# Altium schematic sheet Sheet1.SchDoc
size 558 x 431 mm; SheetNumber: 1; SheetTotal: 1
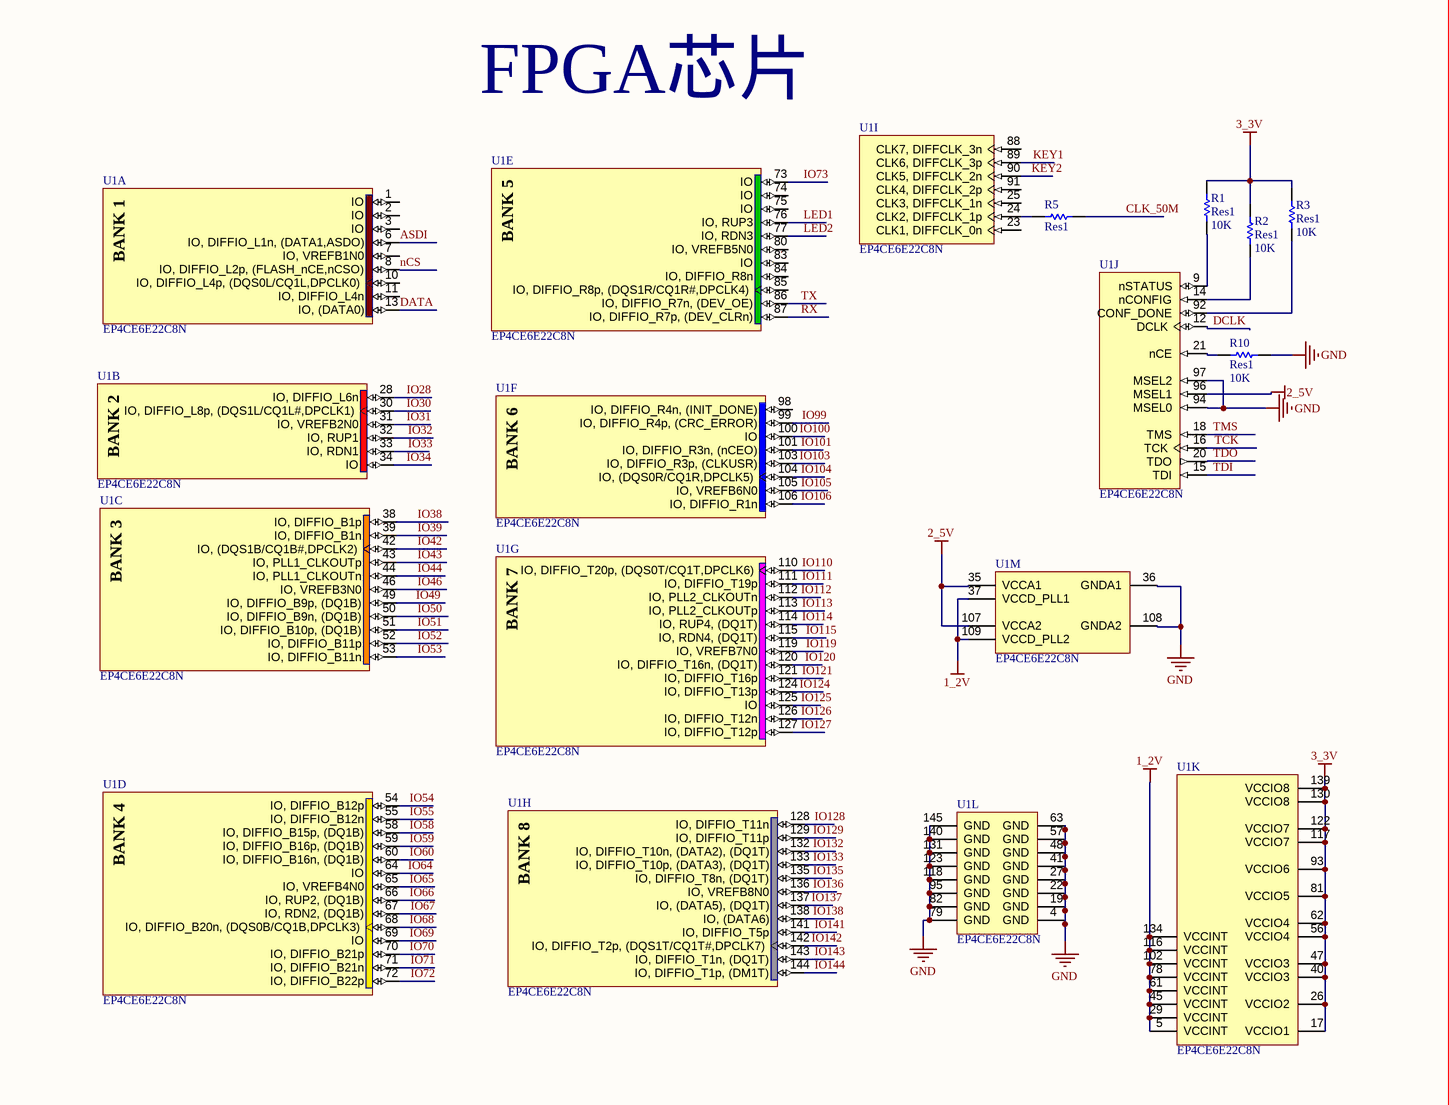
[diagram p0: Sheet1.SchDoc, top left]
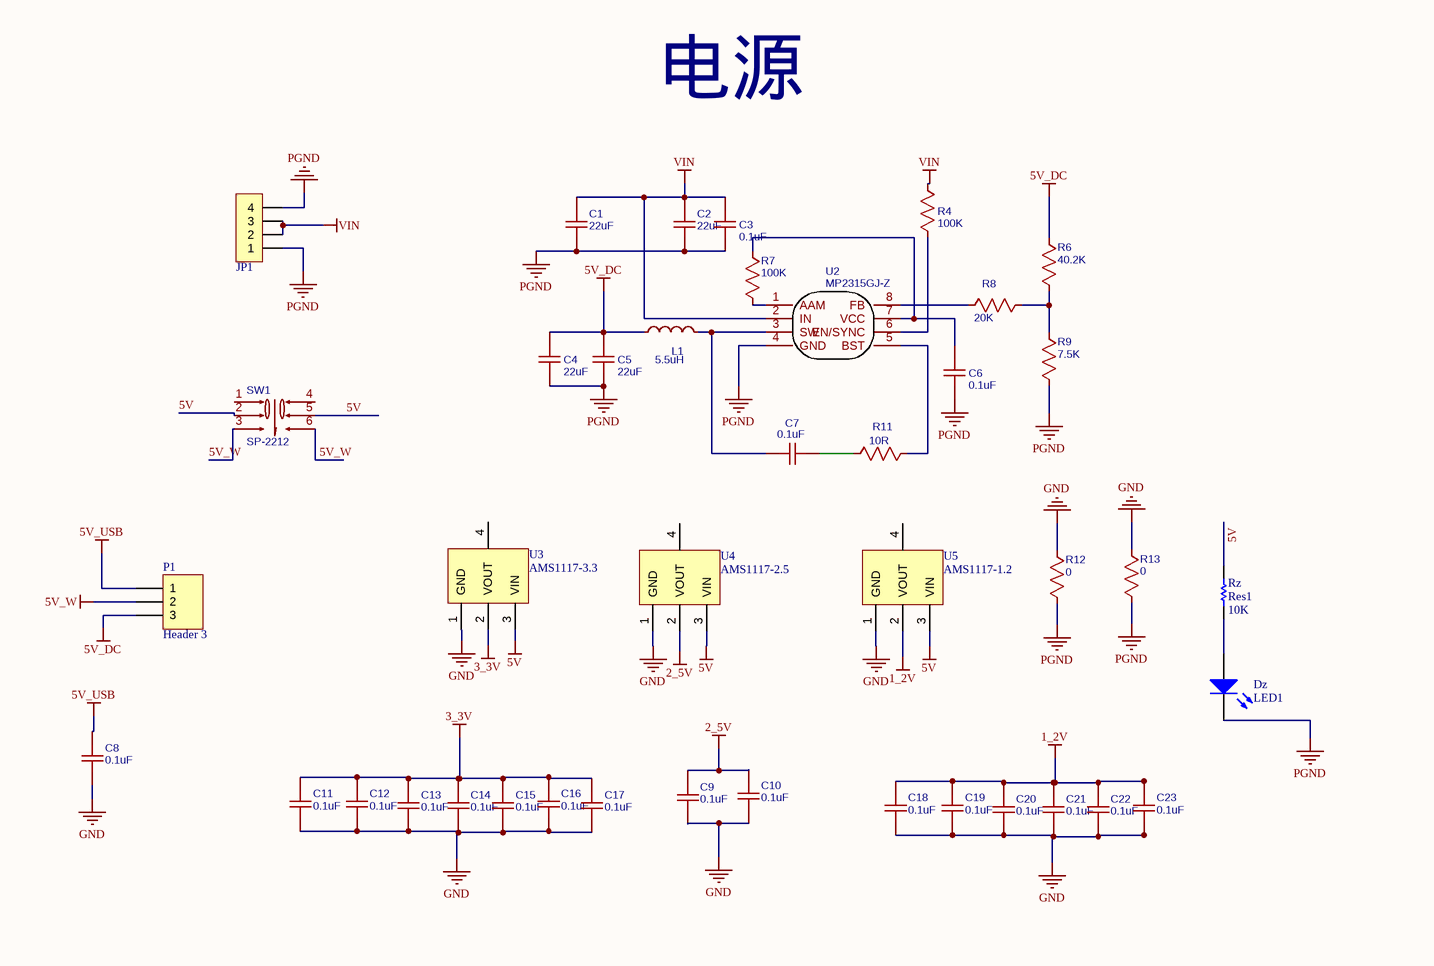
[diagram p1: Sheet1.SchDoc, top right]
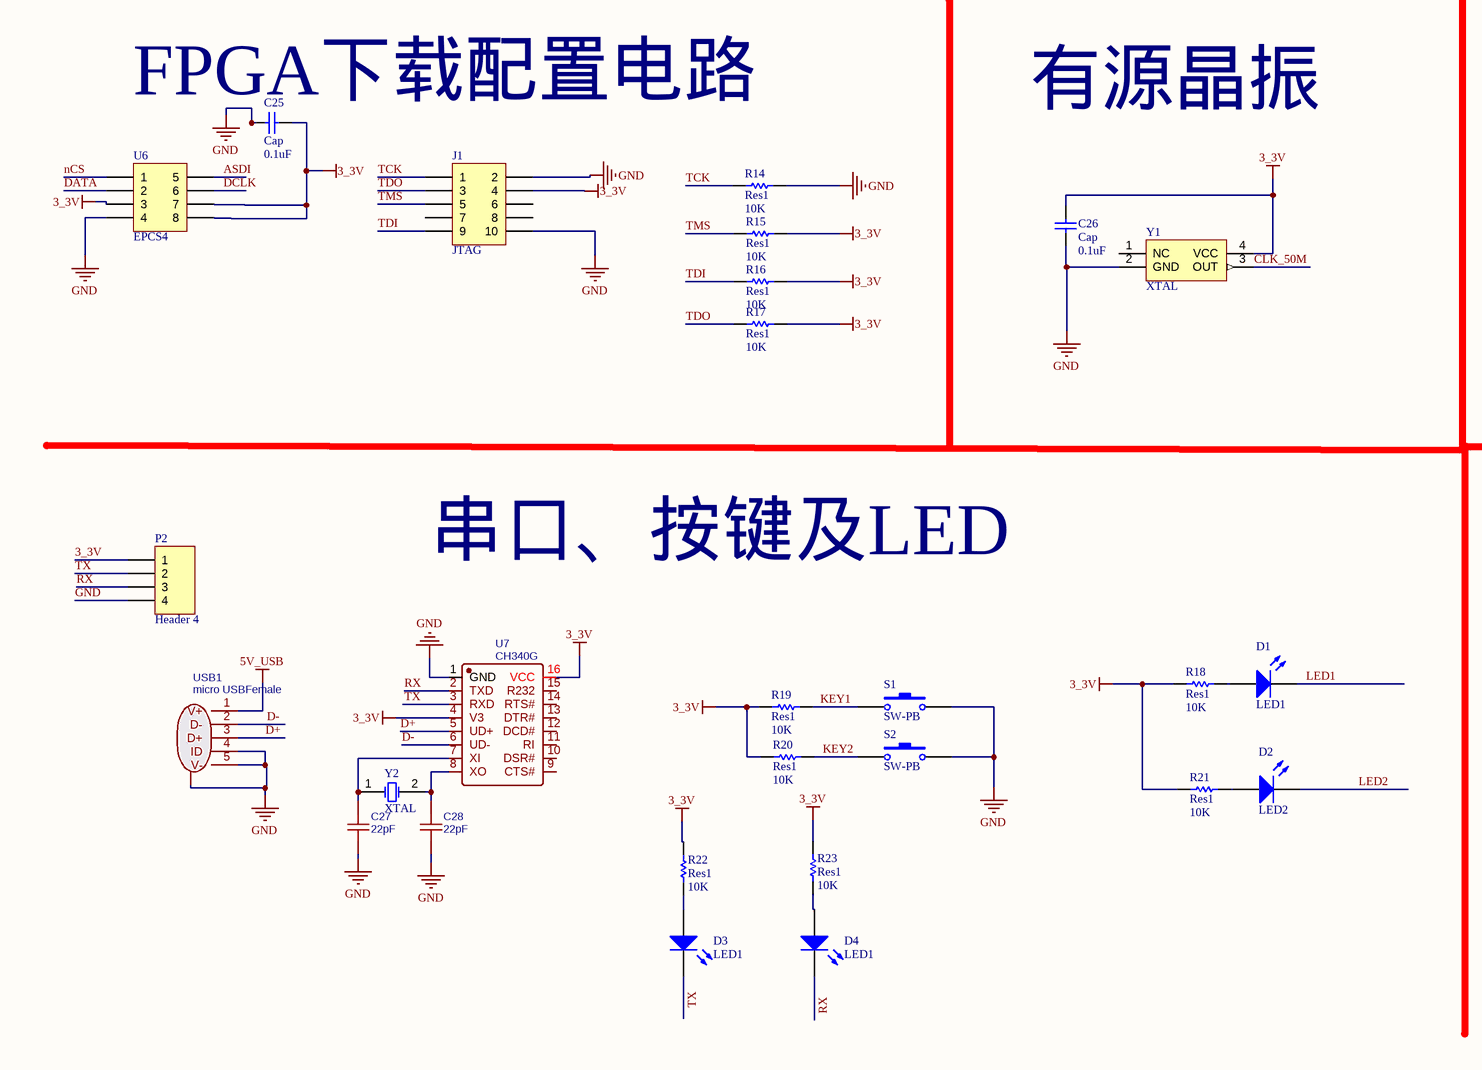
[diagram p2: Sheet1.SchDoc, bottom left]
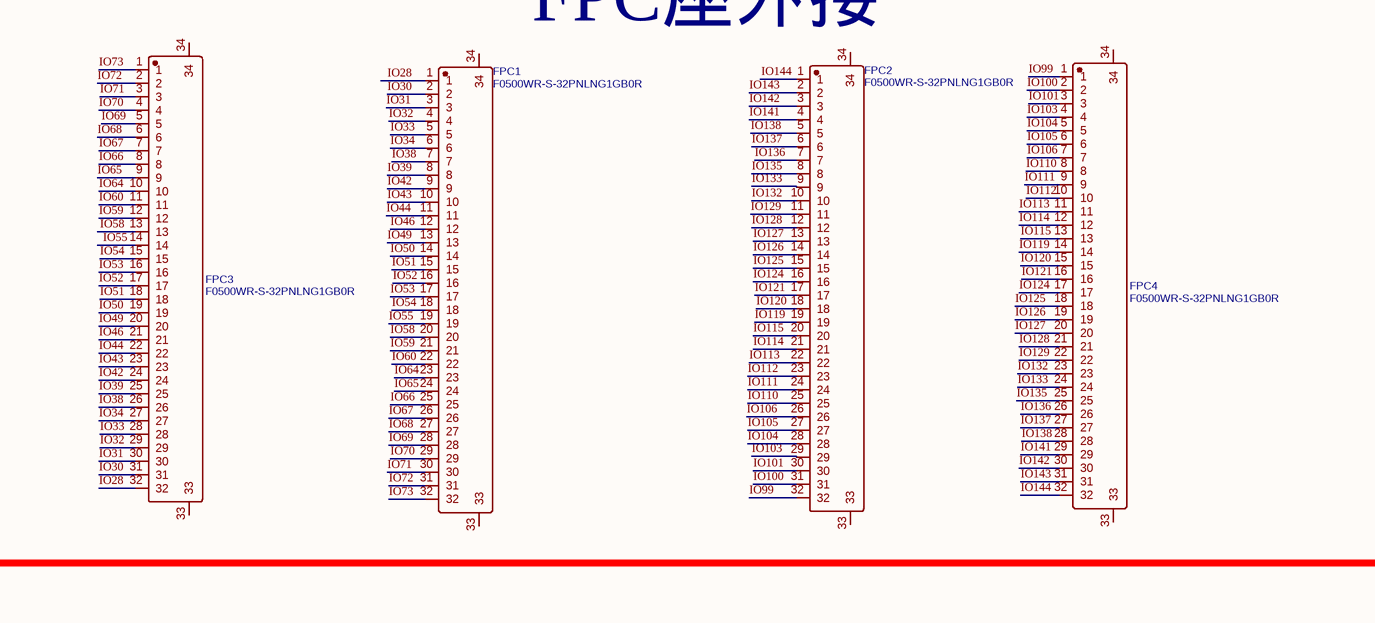
[diagram p3: Sheet1.SchDoc, bottom right]

## Parts
C1  22uF  [C 0805_M]
C2  22uF  [C 0603_M]
C3  0.1uF  [C 0805_M]
C4  22uF  [C 0805_M]
C5  22uF  [C 0805_M]
C6  0.1uF  [C 0603_M]
C7  0.1uF  [C 0805_M]
C8  0.1uF  [C 0805_M]
C9  0.1uF  [C 0603_M]
C10  0.1uF  [C 0603_M]
C11  0.1uF  [C 0603_M]
C12  0.1uF  [C 0603_M]
C13  0.1uF  [C 0603_M]
C14  0.1uF  [C 0603_M]
C15  0.1uF  [C 0603_M]
C16  0.1uF  [C 0603_M]
C17  0.1uF  [C 0603_M]
C18  0.1uF  [C 0603_M]
C19  0.1uF  [C 0603_M]
C20  0.1uF  [C 0603_M]
C21  0.1uF  [C 0603_M]
C22  0.1uF  [C 0603_M]
C23  0.1uF  [C 0603_M]
C25  Cap  value 0.1uF  [C 0805_M]
C26  Cap  value 0.1uF  [C 0805_M]
C27  22pF  [C 0603_M]
C28  22pF  [C 0603_M]
D1  LED1  [LED-0805]
D2  LED2  [LED-0805]
D3  LED1  [LED-0805]
D4  LED1  [LED-0805]
Dz  LED1  [LED-0805]
FPC1  F0500WR-S-32PNLNG1GB0R  [FPC0.5 2H-WS-32P]
FPC2  F0500WR-S-32PNLNG1GB0R  [FPC0.5 2H-WS-32P]
FPC3  F0500WR-S-32PNLNG1GB0R  [FPC0.5 2H-WS-32P]
FPC4  F0500WR-S-32PNLNG1GB0R  [FPC0.5 2H-WS-32P]
J1  JTAG  [牛角座10p]
JP1  HDR-1X4  [KF128-5.08-4P]  (value not drawn)
L1  5.5uH  [L-SMD-0630]
P1  Header 3  [HDR1X3]
P2  Header 4  [HDR1X4]
R1  Res1  value 10K  [R 0603_M]
R2  Res1  value 10K  [R 0603_M]
R3  Res1  value 10K  [R 0603_M]
R4  100K  [R 0603_M]
R5  Res1  [R 0603_M]
R6  40.2K  [R 0603_M]
R7  100K  [R 0603_M]
R8  20K  [R 0603_M]
R9  7.5K  [R 0603_M]
R10  Res1  value 10K  [R 0603_M]
R11  10R  [R 0603_M]
R12  0  [R 0603_M]
R13  0  [R 0603_M]
R14  Res1  value 10K  [R 0603_M]
R15  Res1  value 10K  [R 0603_M]
R16  Res1  value 10K  [R 0603_M]
R17  Res1  value 10K  [R 0603_M]
R18  Res1  value 10K  [R 0603_M]
R19  Res1  value 10K  [R 0603_M]
R20  Res1  value 10K  [R 0603_M]
R21  Res1  value 10K  [R 0603_M]
R22  Res1  value 10K  [R 0603_M]
R23  Res1  value 10K  [R 0603_M]
Rz  Res1  value 10K  [R 0603_M]
S1  SW-PB  [SPST4]
S2  SW-PB  [SPST4]
SW1  SP-2212  [自锁开关]
U1  EP4CE6E22C8N  [EQFP144_A-165_D2-54_N]  (parts A,B,C,D,E,F,G,H,I,J,K,L,M of 13)
U2  MP2315GJ-Z  [SOT23-8N]
U3  AMS1117-3.3  [SOT223_N]
U4  AMS1117-2.5  [SOT223_N]
U5  AMS1117-1.2  [SOT223_N]
U6  EPCS4  [SOP8]
U7  CH340G  [SOIC-16_L9.9-W3.9-P1.27-LS6.0-BL]
USB1  micro USBFemale  [MICRO-USB-SMD_5P-P0.65-H-F_C10418]
Y1  XTAL  [OSC-SMD_4P-L7.0-W5.0-BL]
Y2  XTAL  [标准晶振]

## Nets
1_2V: C18.2 C19.2 C20.2 C21.2 C22.2 C23.2 U1.5(VCCINT) U1.29(VCCINT) U1.37(VCCD_PLL1) U1.45(VCCINT) U1.61(VCCINT) U1.78(VCCINT) U1.102(VCCINT) U1.109(VCCD_PLL2) U1.116(VCCINT) U1.134(VCCINT) U5.2(VOUT)
2_5V: C9.2 C10.2 U1.35(VCCA1) U1.96(MSEL1) U1.107(VCCA2) U4.2(VOUT)
3_3V: C11.2 C12.2 C13.2 C14.2 C15.2 C16.2 C17.2 C25.2 C26.2 J1.4 P2.1 R1.2 R2.2 R3.2 R15.2 R16.2 R17.2 R18.2 R19.2 R20.2 R21.2 R22.1 R23.1 U1.17(VCCIO1) U1.26(VCCIO2) U1.40(VCCIO3) U1.47(VCCIO3) U1.56(VCCIO4) U1.62(VCCIO4) U1.81(VCCIO5) U1.93(VCCIO6) U1.117(VCCIO7) U1.122(VCCIO7) U1.130(VCCIO8) U1.139(VCCIO8) U3.2(VOUT) U6.3 U6.7 U6.8 U7.4(V3) U7.16(VCC) Y1.4(VCC)
5V: Rz.2 SW1.2 SW1.5 U3.3(VIN) U4.3(VIN) U5.3(VIN)
5V_DC: C4.2 C5.2 L1.1 P1.3 R6.1
5V_USB: C8.2 P1.1 USB1.1(V+)
5V_W: P1.2 SW1.3 SW1.6
GND: C8.1 C9.1 C10.1 C11.1 C12.1 C13.1 C14.1 C15.1 C16.1 C17.1 C18.1 C19.1 C20.1 C21.1 C22.1 C23.1 C25.1 C26.1 C27.1 C28.1 J1.2 J1.10 P2.4 R10.1 R12.1 R13.1 R14.2 S1.2 S2.2 U1.4(GND) U1.19(GND) U1.22(GND) U1.27(GND) U1.36(GNDA1) U1.41(GND) U1.48(GND) U1.57(GND) U1.63(GND) U1.79(GND) U1.82(GND) U1.94(MSEL0) U1.95(GND) U1.97(MSEL2) U1.108(GNDA2) U1.118(GND) U1.123(GND) U1.131(GND) U1.140(GND) U1.145(GND) U3.1(GND) U4.1(GND) U5.1(GND) U6.4 U7.1(GND) USB1.0(MTN) USB1.4(ID) USB1.5(V-) Y1.2(GND)
PGND: C1.2 C2.2 C3.1 C4.1 C5.1 C6.1 Dz.2(K) JP1.1 JP1.4 R9.2 R12.2 R13.2 U2.4(GND)
VIN: C1.1 C2.1 C3.2 JP1.2 JP1.3 R4.2 U2.2(IN)
ASDI: U1.6(IO,_DIFFIO_L1n,_(DATA1,ASDO)) U6.5
CLK_50M: R5.2 Y1.3(OUT)
D+: U7.5(UD+) USB1.3(D+)
D-: U7.6(UD-) USB1.2(D-)
DATA: U1.13(IO,_(DATA0)) U6.2
DCLK: U1.12(DCLK) U6.6
IO28: FPC1.1 FPC3.32 U1.28(IO,_DIFFIO_L6n)
IO30: FPC1.2 FPC3.31 U1.30(IO,_DIFFIO_L8p,_(DQS1L/CQ1L#,DPCLK1))
IO31: FPC1.3 FPC3.30 U1.31(IO,_VREFB2N0)
IO32: FPC1.4 FPC3.29 U1.32(IO,_RUP1)
IO33: FPC1.5 FPC3.28 U1.33(IO,_RDN1)
IO34: FPC1.6 FPC3.27 U1.34(IO)
IO38: FPC1.7 FPC3.26 U1.38(IO,_DIFFIO_B1p)
IO39: FPC1.8 FPC3.25 U1.39(IO,_DIFFIO_B1n)
IO42: FPC1.9 FPC3.24 U1.42(IO,_(DQS1B/CQ1B#,DPCLK2))
IO43: FPC1.10 FPC3.23 U1.43(IO,_PLL1_CLKOUTp)
IO44: FPC1.11 FPC3.22 U1.44(IO,_PLL1_CLKOUTn)
IO46: FPC1.12 FPC3.21 U1.46(IO,_VREFB3N0)
IO49: FPC1.13 FPC3.20 U1.49(IO,_DIFFIO_B9p,_(DQ1B))
IO50: FPC1.14 FPC3.19 U1.50(IO,_DIFFIO_B9n,_(DQ1B))
IO51: FPC1.15 FPC3.18 U1.51(IO,_DIFFIO_B10p,_(DQ1B))
IO52: FPC1.16 FPC3.17 U1.52(IO,_DIFFIO_B11p)
IO53: FPC1.17 FPC3.16 U1.53(IO,_DIFFIO_B11n)
IO54: FPC1.18 FPC3.15 U1.54(IO,_DIFFIO_B12p)
IO55: FPC1.19 FPC3.14 U1.55(IO,_DIFFIO_B12n)
IO58: FPC1.20 FPC3.13 U1.58(IO,_DIFFIO_B15p,_(DQ1B))
IO59: FPC1.21 FPC3.12 U1.59(IO,_DIFFIO_B16p,_(DQ1B))
IO60: FPC1.22 FPC3.11 U1.60(IO,_DIFFIO_B16n,_(DQ1B))
IO64: FPC1.23 FPC3.10 U1.64(IO)
IO65: FPC1.24 FPC3.9 U1.65(IO,_VREFB4N0)
IO66: FPC1.25 FPC3.8 U1.66(IO,_RUP2,_(DQ1B))
IO67: FPC1.26 FPC3.7 U1.67(IO,_RDN2,_(DQ1B))
IO68: FPC1.27 FPC3.6 U1.68(IO,_DIFFIO_B20n,_(DQS0B/CQ1B,DPCLK3))
IO69: FPC1.28 FPC3.5 U1.69(IO)
IO70: FPC1.29 FPC3.4 U1.70(IO,_DIFFIO_B21p)
IO71: FPC1.30 FPC3.3 U1.71(IO,_DIFFIO_B21n)
IO72: FPC1.31 FPC3.2 U1.72(IO,_DIFFIO_B22p)
IO73: FPC1.32 FPC3.1 U1.73(IO)
IO99: FPC2.32 FPC4.1 U1.99(IO,_DIFFIO_R4p,_(CRC_ERROR))
IO100: FPC2.31 FPC4.2 U1.100(IO)
IO101: FPC2.30 FPC4.3 U1.101(IO,_DIFFIO_R3n,_(nCEO))
IO103: FPC2.29 FPC4.4 U1.103(IO,_DIFFIO_R3p,_(CLKUSR))
IO104: FPC2.28 FPC4.5 U1.104(IO,_(DQS0R/CQ1R,DPCLK5))
IO105: FPC2.27 FPC4.6 U1.105(IO,_VREFB6N0)
IO106: FPC2.26 FPC4.7 U1.106(IO,_DIFFIO_R1n)
IO110: FPC2.25 FPC4.8 U1.110(IO,_DIFFIO_T20p,_(DQS0T/CQ1T,DPCLK6))
IO111: FPC2.24 FPC4.9 U1.111(IO,_DIFFIO_T19p)
IO112: FPC2.23 FPC4.10 U1.112(IO,_PLL2_CLKOUTn)
IO113: FPC2.22 FPC4.11 U1.113(IO,_PLL2_CLKOUTp)
IO114: FPC2.21 FPC4.12 U1.114(IO,_RUP4,_(DQ1T))
IO115: FPC2.20 FPC4.13 U1.115(IO,_RDN4,_(DQ1T))
IO119: FPC2.19 FPC4.14 U1.119(IO,_VREFB7N0)
IO120: FPC2.18 FPC4.15 U1.120(IO,_DIFFIO_T16n,_(DQ1T))
IO121: FPC2.17 FPC4.16 U1.121(IO,_DIFFIO_T16p)
IO124: FPC2.16 FPC4.17 U1.124(IO,_DIFFIO_T13p)
IO125: FPC2.15 FPC4.18 U1.125(IO)
IO126: FPC2.14 FPC4.19 U1.126(IO,_DIFFIO_T12n)
IO127: FPC2.13 FPC4.20 U1.127(IO,_DIFFIO_T12p)
IO128: FPC2.12 FPC4.21 U1.128(IO,_DIFFIO_T11n)
IO129: FPC2.11 FPC4.22 U1.129(IO,_DIFFIO_T11p)
IO132: FPC2.10 FPC4.23 U1.132(IO,_DIFFIO_T10n,_(DATA2),_(DQ1T))
IO133: FPC2.9 FPC4.24 U1.133(IO,_DIFFIO_T10p,_(DATA3),_(DQ1T))
IO135: FPC2.8 FPC4.25 U1.135(IO,_DIFFIO_T8n,_(DQ1T))
IO136: FPC2.7 FPC4.26 U1.136(IO,_VREFB8N0)
IO137: FPC2.6 FPC4.27 U1.137(IO,_(DATA5),_(DQ1T))
IO138: FPC2.5 FPC4.28 U1.138(IO,_(DATA6))
IO141: FPC2.4 FPC4.29 U1.141(IO,_DIFFIO_T5p)
IO142: FPC2.3 FPC4.30 U1.142(IO,_DIFFIO_T2p,_(DQS1T/CQ1T#,DPCLK7))
IO143: FPC2.2 FPC4.31 U1.143(IO,_DIFFIO_T1n,_(DQ1T))
IO144: FPC2.1 FPC4.32 U1.144(IO,_DIFFIO_T1p,_(DM1T))
KEY1: R19.1 S1.1 U1.89(CLK6,_DIFFCLK_3p)
KEY2: R20.1 S2.1 U1.90(CLK5,_DIFFCLK_2n)
LED1: D1.2(K) U1.76(IO,_RUP3)
LED2: D2.2(K) U1.77(IO,_RDN3)
nCS: U1.8(IO,_DIFFIO_L2p,_(FLASH_nCE,nCSO)) U6.1
RX: D4.2(K) P2.3 U1.87(IO,_DIFFIO_R7p,_(DEV_CLRn)) U7.2(TXD)
TCK: J1.1 R14.1 U1.16(TCK)
TDI: J1.9 R16.1 U1.15(TDI)
TDO: J1.3 R17.1 U1.20(TDO)
TMS: J1.5 R15.1 U1.18(TMS)
TX: D3.2(K) P2.2 U1.86(IO,_DIFFIO_R7n,_(DEV_OE)) U7.3(RXD)
NetC6_2: C6.2 R7.1 U2.7(VCC)
NetC7_1: C7.1 L1.2 U2.3(SW)
NetC7_2: C7.2 R11.2
NetC27_2: C27.2 U7.7(XI) Y2.1(OSC1)
NetC28_2: C28.2 U7.8(XO) Y2.2(OSC2)
NetD1_1: D1.1(A) R18.1
NetD2_1: D2.1(A) R21.1
NetD3_1: D3.1(A) R22.2
NetD4_1: D4.1(A) R23.2
NetDz_1: Dz.1(A) Rz.1
NetR1_1: R1.1 U1.9(nSTATUS)
NetR2_1: R2.1 U1.14(nCONFIG)
NetR3_1: R3.1 U1.92(CONF_DONE)
NetR4_1: R4.1 U2.6(EN/SYNC)
NetR5_1: R5.1 U1.24(CLK2,_DIFFCLK_1p)
NetR6_2: R6.2 R8.1 R9.1
NetR7_2: R7.2 U2.1(AAM)
NetR8_2: R8.2 U2.8(FB)
NetR10_2: R10.2 U1.21(nCE)
NetR11_1: R11.1 U2.5(BST)

Not connected (* = marked no-connect by the designer): FPC1 33 34; FPC2 33 34; FPC3 33 34; FPC4 33 34; J1 6 7 8; SW1 1 4; U1 1(IO) 2(IO) 3(IO) 7(IO,_VREFB1N0) 10(IO,_DIFFIO_L4p,_(DQS0L/CQ1L,DPCLK0)) 11(IO,_DIFFIO_L4n) 23(CLK1,_DIFFCLK_0n) 25(CLK3,_DIFFCLK_1n) 74(IO) 75(IO) 80(IO,_VREFB5N0) 83(IO) 84(IO,_DIFFIO_R8n) 85(IO,_DIFFIO_R8p,_(DQS1R/CQ1R#,DPCLK4)) 88(CLK7,_DIFFCLK_3n) 91(CLK4,_DIFFCLK_2p) 98(IO,_DIFFIO_R4n,_(INIT_DONE)); U3 4(VOUT); U4 4(VOUT); U5 4(VOUT); U7 9(CTS#) 10(DSR#) 11(RI) 12(DCD#) 13(DTR#) 14(RTS#) 15(R232); Y1 1(NC)

## Notes on the sheet
- FPGA芯片
- 电源
- FPC座外接
- (near C25) FPGA下载配置电路
- 有源晶振
- 串口、按键及LED
- DWG. NO.
- REV.
- SHT.
- REVISION
- DESCRIPTION
- DATE
- APPROVED
- THIS DOCUMENT AND THE DATA DISCLOSED HEREIN OR HEREWITH IS THE PROPERTY OF ALTIUM LIMITED AND MAY BE FREELY DISTRIBUTED IN WHOLE. NO RIGHTS ARE RESERVED OR EXPRESS OR IMPLIED WARANTEE GIVEN.
- ENG:
- DSN:
- APPROVALS
- PROJECT
- DOCUMENT REVISION:
- DESIGN ITEM:
- CHK:
- BOM:
- REFERENCE DOCUMENTS
- PROJECT REVISION:
- TITLE
- FAB DWG:
- PCB DWG:
- ASSY DWG:
- SCALE:
- SIZE
- C
- CAGE CODE
- FILE NAME
- DWG NO.
- SHEET
- OF
- REV
- (in symbol EP4CE6E22C8N, part A) BANK 1
- (in symbol EP4CE6E22C8N, part B) BANK 2
- (in symbol EP4CE6E22C8N, part C) BANK 3
- (in symbol EP4CE6E22C8N, part D) BANK 4
- (in symbol EP4CE6E22C8N, part E) BANK 5
- (in symbol EP4CE6E22C8N, part F) BANK 6
- (in symbol EP4CE6E22C8N, part G) BANK 7
- (in symbol EP4CE6E22C8N, part H) BANK 8

## Library data of the parts
C1 C2 C4 C5 = 22uF: nameAlias: Value(F); Contributor: LCEDA_Lib; spicePre: C; spiceSymbolName: C_0805_US
C3 C6-C23 C27 C28 = 0.1uF: nameAlias: Value(F); Contributor: LCEDA_Lib; spicePre: C; spiceSymbolName: C_0603_US
C25 C26 = Cap: Capacitor; Published: 8-Jun-2000; LatestRevisionDate: 17-Jul-2002; LatestRevisionNote: Re-released for DXP Platform.; PackageReference: RAD-0.3; Publisher: Altium Limited; PackageDescription: Radial Cap, Thru-Hole; 2 Leads; 0.3 in Pin Spacing
D1-D4 Dz = LED0: Typical INFRARED GaAs LED; Published: 8-Jun-2000; LatestRevisionDate: 08-Jul-2005; LatestRevisionNote: Mech Layer 1 removed.; PackageReference: LED-0; Publisher: Altium Limited; PackageDescription: LED; 2 Leads
FPC1-FPC4 = F0500WR-S-32PNLNG1GB0R: BOM_Manufacturer: HR; Contributor: LCSC; BOM_Supplier: LCSC; BOM_Supplier Part: C247880; BOM_Manufacturer Part: F0500WR-S-32PNLNG1GB0R; BOM_JLCPCB Part Class: Extended Part; spicePre: F; spiceSymbolName: F0500WR-S-32PNLNG1GB0R
J1 = Header 5X2H: Header, 5-Pin, Dual row, Right Angle; LatestRevisionDate: 17-Jul-2002; LatestRevisionNote: Re-released for DXP Platform.; Publisher: Altium Limited
JP1 = Header 4: 4P接插件; 版权归属: 封装库来自淘宝卖家 ID：黄晶宝石; BOM名称: 4P接插件; 学习资源: https://shop463601444.taobao.com
L1 = 4.7uH: BOM_Manufacturer: MAZO; BOM_Manufacturer Part: MPCA-0624-4R7-M; nameAlias: Inductance; Contributor: LCSC; BOM_Supplier: LCSC; BOM_Supplier Part: C268387; spicePre: L; spiceSymbolName: MPCA-0624-4R7-M
P1 = Header 3: Header, 3-Pin; LatestRevisionDate: 17-Jul-2002; LatestRevisionNote: Re-released for DXP Platform.; Publisher: Altium Limited
P2 = Header 4: Header, 4-Pin; LatestRevisionDate: 17-Jul-2002; LatestRevisionNote: Re-released for DXP Platform.; Publisher: Altium Limited
R1-R3 R5 R10 R14-R23 Rz = Res1: Resistor; Published: 8-Jun-2000; LatestRevisionDate: 17-Jul-2002; LatestRevisionNote: Re-released for DXP Platform.; PackageReference: AXIAL-0.3; Publisher: Altium Limited; PackageDescription: Axial Device, Thru-Hole; 2 Leads; 0.3 in Pin Spacing
R4 = 100K: Contributor: LCEDA_Lib; spicePre: R; spiceSymbolName: R_0603_US
R6 R8 R9 R11-R13 = 10R: Contributor: LCEDA_Lib; spicePre: R; spiceSymbolName: R_0603_US
R7 = 7.5k: Contributor: LCEDA_Lib; spicePre: R; spiceSymbolName: R_0603_US
S1 S2 = SW-PB: Switch; Published: 24-Mar-1999; LatestRevisionDate: 17-Jul-2002; LatestRevisionNote: Re-released for DXP Platform.; PackageReference: SPST-2; Publisher: Altium Limited; PackageDescription: Switch; 2 Leads
SW1 = SP-2212: BOM_Manufacturer: RI SHENG; Contributor: LCSC; BOM_Supplier: LCSC; BOM_Supplier Part: C589287; BOM_Manufacturer Part: SP-2212; BOM_JLCPCB Part Class: Extended Part; spicePre: S; spiceSymbolName: SP-2212
U1 = EP4CE6E22C8N: Cyclone IV Family FPGA, 1.2V Core, 91 I/O Pins, 2 PLLs, 144-Pin QFP, Speed Grade 8, Commercial Grade, Pb-Free; Manufacturer: Altera; DatasheetVersion: ver1.6, Nov-2011; PackageVersion: ver1.0, Jan-2011; PackageReference: EQFP144_A-165_D2-54; PackageDescription: 144-Pin Plastic Enhanced Quad Flat Pack (EQFP) - Wire Bond - A:1.65 - D2:5.4; Code_JEDEC: MS-026-BFB-HD; ComponentLink1Description: Manufacturer URL; ComponentLink1URL: http://www.altera.com/; ComponentLink2Description: Handbook; ComponentLink2URL: http://www.altera.com/literature/hb/cyclone-iv/cyclone4-handbook.pdf; ComponentLink3Description: Pinout; ComponentLink3URL: http://www.altera.com/literature/lit-dp.jsp?category=cyc%204&showspreadsheet=y; ComponentLink4Description: Package Specification; ComponentLink4URL: http://www.altera.com/devicepackaging/04R00402-00.pdf
U2 = MP2315GJ-Z: BOM_Manufacturer: MPS; BOM_Supplier: LCSC; BOM_Manufacturer Part: MP2315GJ-Z; BOM_Supplier Part: C45889; BOM_JLCPCB Part Class: Extended Part; spicePre: U; spiceSymbolName: MP2315GJ-Z
U3-U5 = AMS1117: 3.3Voutput,4.3-12Vinput LDO
U6 = Header 4X2A: Header, 4-Pin, Dual row; LatestRevisionDate: 17-Jul-2002; LatestRevisionNote: Re-released for DXP Platform.; Publisher: Altium Limited
U7 = CH340G: BOM_Manufacturer: WCH; timeStamp: 1468327462; BOM_Supplier: LCSC; BOM_Manufacturer Part: CH340G; BOM_Supplier Part: C14267; BOM_JLCPCB Part Class: Extended Part; spicePre: U; spiceSymbolName: CH340G
USB1 = micro USBFemale: BOM_Manufacturer: ValuePro; BOM_Supplier: LCSC; BOM_Manufacturer Part: micro USBFemale; BOM_Supplier Part: C10418; BOM_JLCPCB Part Class: Extended Part; spicePre: U; spiceSymbolName: micro USBFemale
Y1 = 有源晶振
Y2 = XTAL: Crystal Oscillator; Published: 8-Jun-2000; LatestRevisionDate: 17-Jul-2002; LatestRevisionNote: Re-released for DXP Platform.; PackageReference: R38; Publisher: Altium Limited; PackageDescription: Crystal, Thru-Hole; 2 Leads; Body 3.1 x 8.2 mm (Dia.xH)